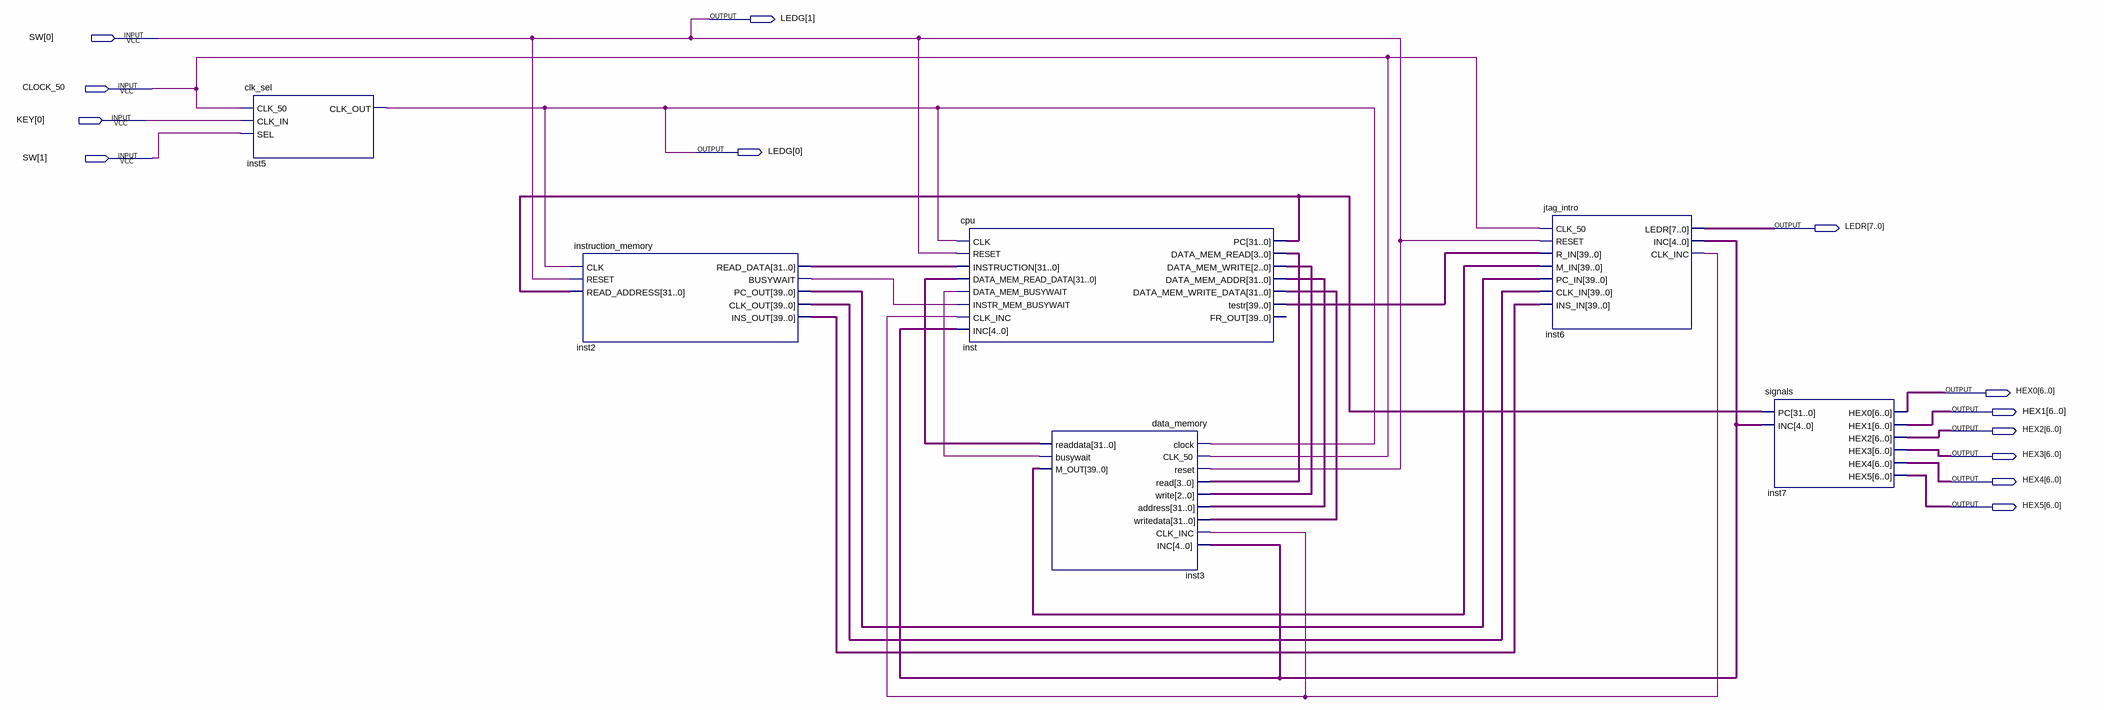
[diagram p0: schematic sheet]
// Quartus schematic RV32IMF_FPGA.bdf as structural Verilog: 6 symbols, 13 pins
module RV32IMF_FPGA (
  input  [1:0] SW,
  input  CLOCK_50,
  input  [0:0] KEY,
  output [1:0] LEDG,
  output [7:0] LEDR,
  output [6:0] HEX0,
  output [6:0] HEX1,
  output [6:0] HEX2,
  output [6:0] HEX3,
  output [6:0] HEX4,
  output [6:0] HEX5
);

  wire inst2_busywait, inst3_busywait, inst6_clk_inc;
  wire [2:0] inst_data_mem_write;
  wire [3:0] inst_data_mem_read;
  wire [4:0] inst6_inc;
  wire [31:0] inst2_read_data, inst3_readdata, inst_data_mem_addr, inst_data_mem_write_data, inst_pc;
  wire [39:0] inst2_clk_out, inst2_ins_out, inst2_pc_out, inst3_m_out, inst_testr;

  clk_sel inst5 (.CLK_50(CLOCK_50), .CLK_IN(KEY[0]), .SEL(SW[1]), .CLK_OUT(LEDG[0]));
  instruction_memory inst2 (
    .CLK(LEDG[0]), .RESET(SW[0]), .READ_ADDRESS(inst_pc), .READ_DATA(inst2_read_data),
    .BUSYWAIT(inst2_busywait), .PC_OUT(inst2_pc_out), .CLK_OUT(inst2_clk_out), .INS_OUT(inst2_ins_out));
  cpu inst (
    .CLK(LEDG[0]), .RESET(SW[0]), .INSTRUCTION(inst2_read_data), .DATA_MEM_READ_DATA(inst3_readdata),
    .DATA_MEM_BUSYWAIT(inst3_busywait), .INSTR_MEM_BUSYWAIT(inst2_busywait), .CLK_INC(inst6_clk_inc),
    .INC(inst6_inc), .PC(inst_pc), .DATA_MEM_READ(inst_data_mem_read), .DATA_MEM_WRITE(inst_data_mem_write),
    .DATA_MEM_ADDR(inst_data_mem_addr), .DATA_MEM_WRITE_DATA(inst_data_mem_write_data), .testr(inst_testr));  // open: FR_OUT
  data_memory inst3 (
    .clock(LEDG[0]), .CLK_50(CLOCK_50), .reset(SW[0]), .read(inst_data_mem_read),
    .write(inst_data_mem_write), .address(inst_data_mem_addr), .writedata(inst_data_mem_write_data),
    .CLK_INC(inst6_clk_inc), .INC(inst6_inc), .readdata(inst3_readdata), .busywait(inst3_busywait),
    .M_OUT(inst3_m_out));
  jtag_intro inst6 (
    .CLK_50(CLOCK_50), .RESET(SW[0]), .R_IN(inst_testr), .M_IN(inst3_m_out), .PC_IN(inst2_pc_out),
    .CLK_IN(inst2_clk_out), .INS_IN(inst2_ins_out), .LEDR(LEDR), .INC(inst6_inc), .CLK_INC(inst6_clk_inc));
  signals inst7 (
    .PC(inst_pc), .INC(inst6_inc), .HEX0(HEX0), .HEX1(HEX1), .HEX2(HEX2), .HEX3(HEX3), .HEX4(HEX4),
    .HEX5(HEX5));

  assign LEDG[1] = SW[0];
endmodule
